# EasyEDA Pro project ProPrj_前板PCB制作_2025-12-27.epro

# Schematic Schematic1
Assembly Variant: Basic; Board Name: Board1; Create Date: 2025-12-19; Page Name: P1; Project Name: 前板PCB制作; Schematic Name: Schematic1; Update Date: 2025-12-19; BladeWidth: 10; Company: 嘉立创EDA; Page Size: A4; RegionStart: 1; ShowBorder: 1; TitleBlock: 1; TitleBlockPosition: 3; Version: V1.0; XRegionCount: 6; YRegionCount: 4
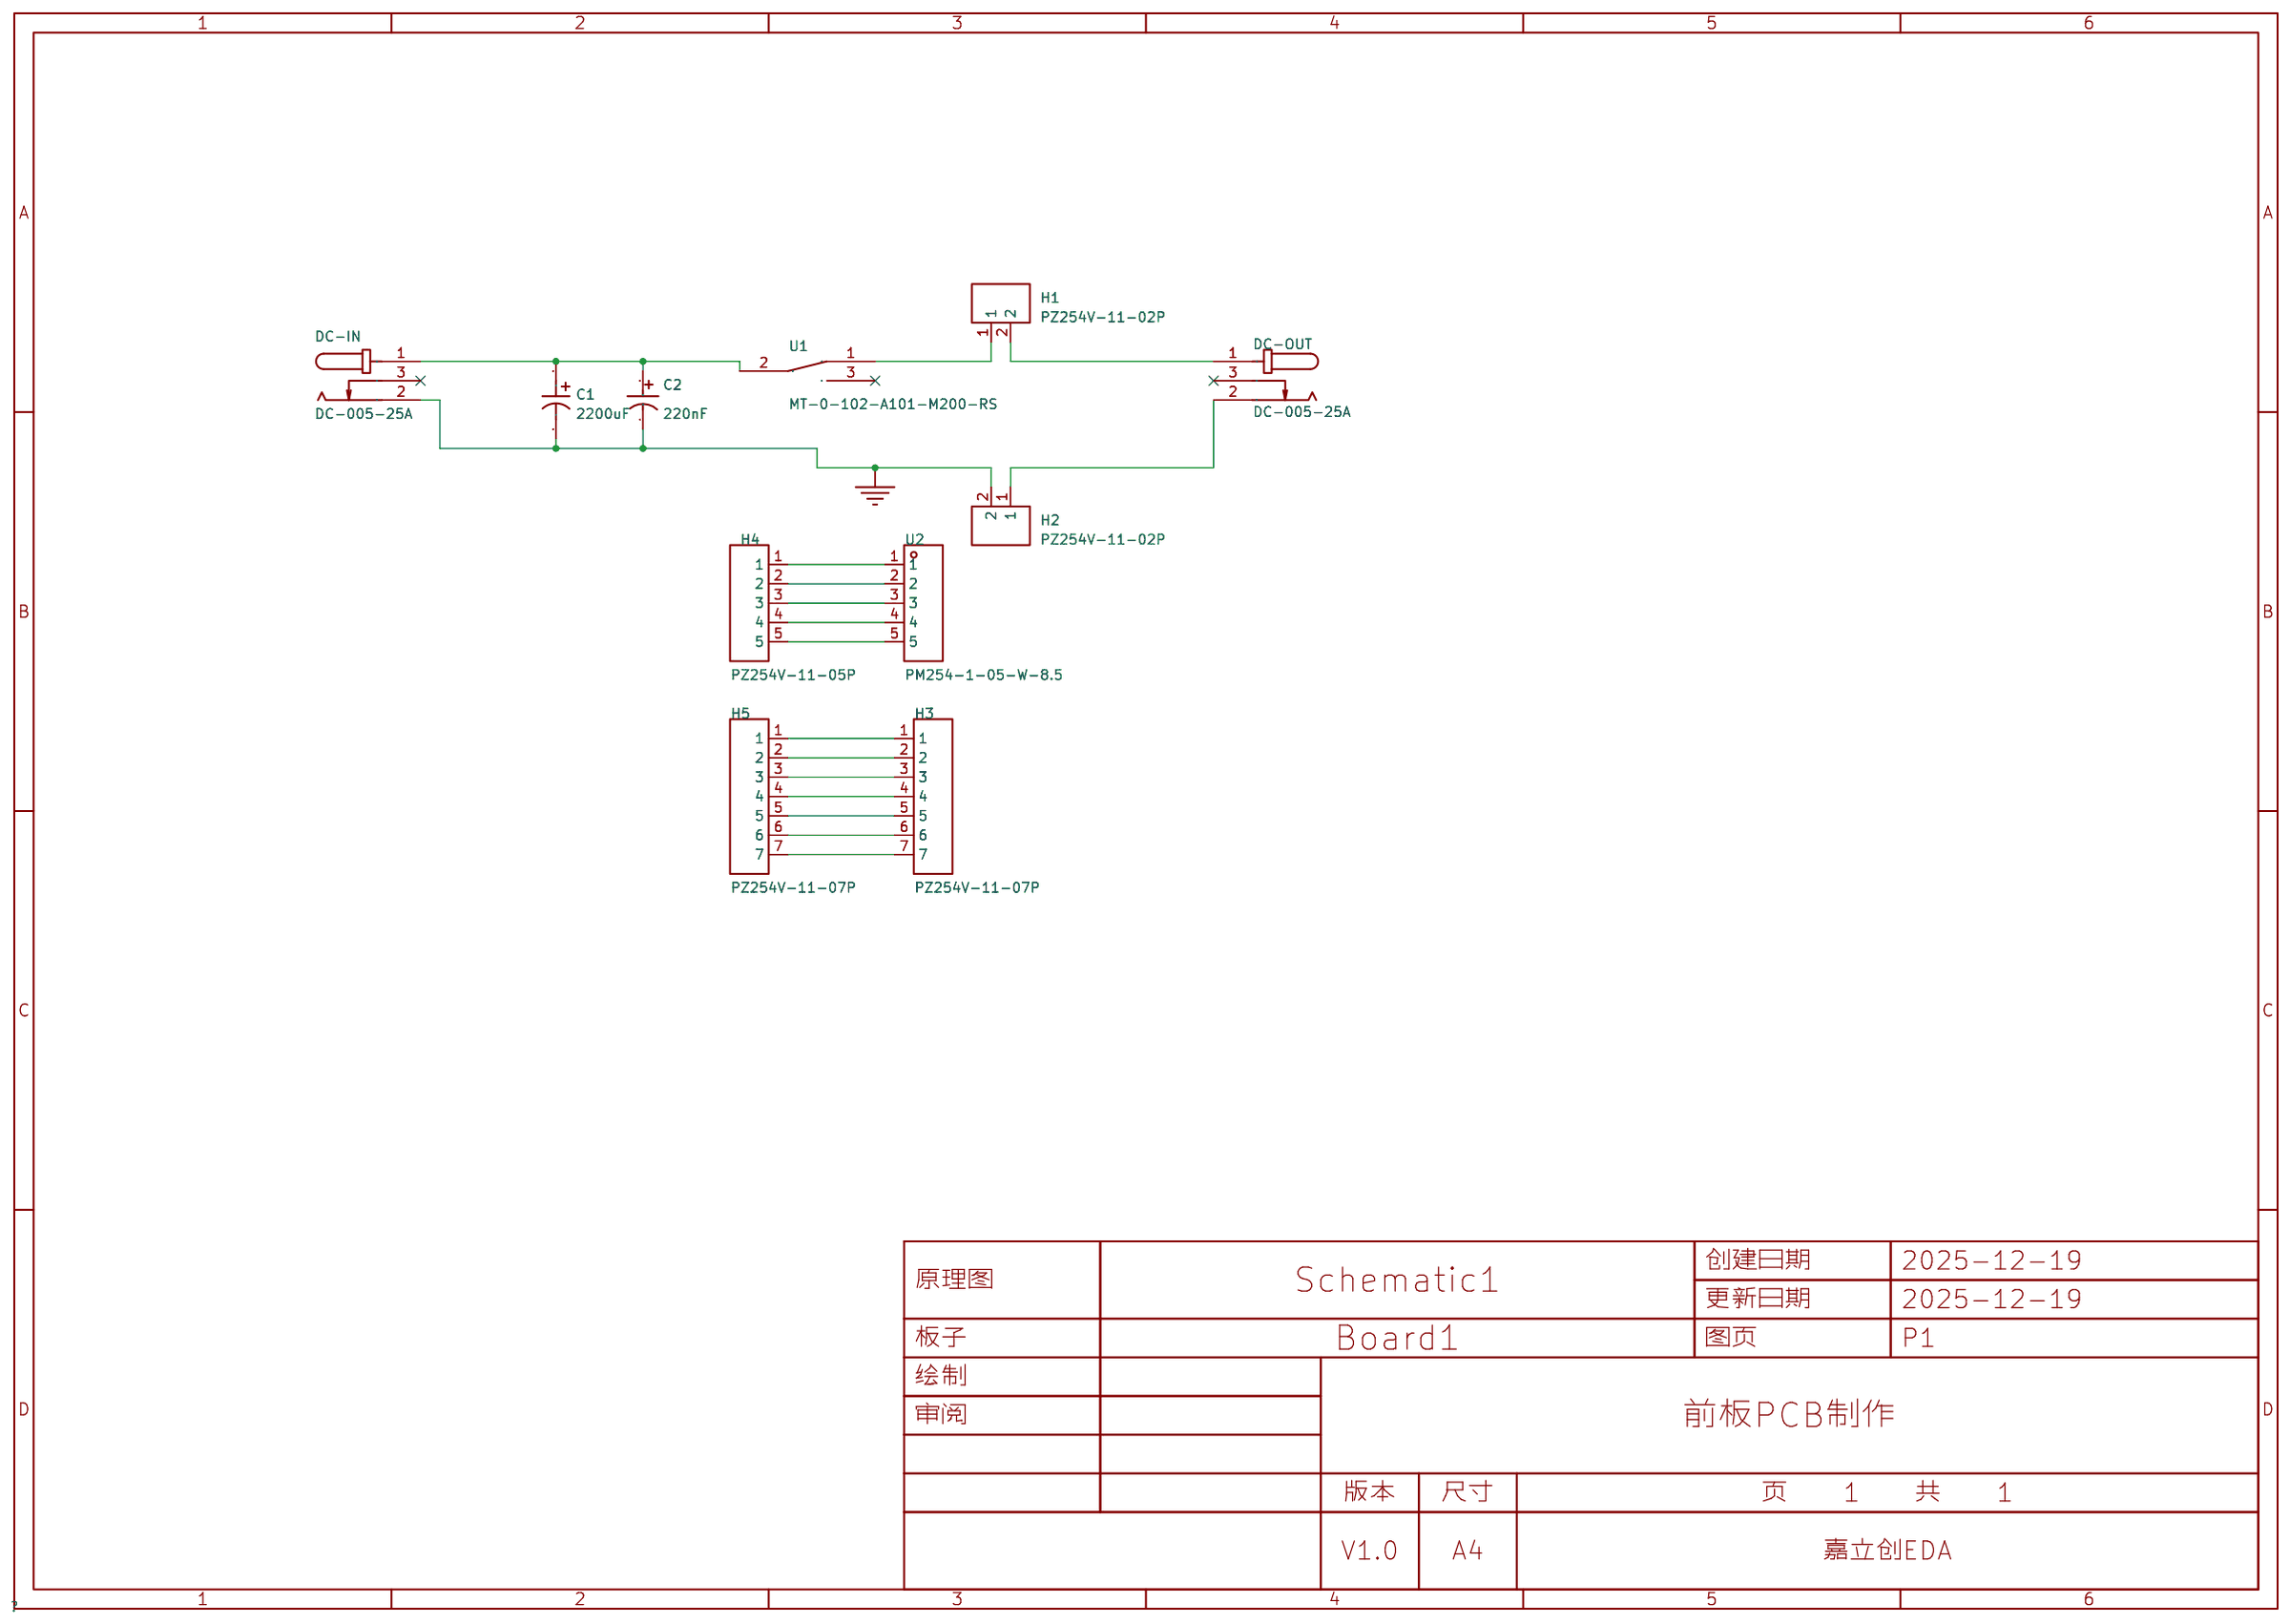
[diagram p0: schematic sheet]

## Parts
C1  2200uF  [CAP-TH_BD13.0-P5.00-D0.6-FD]
C2  220nF  [CAP-TH_BD5.0-P2.00-D0.8-FD]
DC-IN  DC-005-25A  [DC-IN-TH_DC005]
DC-OUT  DC-005-25A  [DC-IN-TH_DC005]
H1  PZ254V-11-02P  [HDR-TH_2P-P2.54-V-M]
H2  PZ254V-11-02P  [HDR-TH_2P-P2.54-V-M]
H3  PZ254V-11-07P  [HDR-TH_7P-P2.54-V-M]
H4  PZ254V-11-05P  [HDR-TH_5P-P2.54-V-M]
H5  PZ254V-11-07P  [HDR-TH_7P-P2.54-V-M]
U1  MT-0-102-A101-M200-RS  [SW-TH_MT-0-103-A101-M200-RS]
U2  PM254-1-05-W-8.5  [HDR-TH_5P-P2.54-H-F-W10.0-N]

## Library data of the parts
C1 = ERA25V2200M13X21: 容值:2200uF;精度:±20%;额定电压:25V;; LCSC Part Name: 2200uF ±20% 25V; Supplier Part: C49256800; Manufacturer: JIERR(捷而瑞); Supplier Footprint: 插件,D13xL21mm; JLCPCB Part Class: Extended Part; Datasheet: https://item.szlcsc.com/datasheet/ERA25V2200M13X21/51692200.html; Supplier: LCSC; Tolerance: ±20%; Voltage Rating: 25V; Pin Spacing: 5mm; Diameter: 13mm; Height - Seated (Max): 21mm; Lifetime: 2000hrs@105℃; Operating Temperature: -40℃~+105℃
C2 = KM224M050D11RR0VH2FP0: 容值:220nF;精度:±20%;额定电压:50V;; LCSC Part Name: 220nF ±20% 50V; Supplier Part: C45096; Manufacturer: Chengx(承兴); Supplier Footprint: 插件,D5xL11mm; JLCPCB Part Class: Extended Part; Datasheet: https://item.szlcsc.com/datasheet/KM224M050D11RR0VH2FP0/46098.html; Supplier: LCSC; Tolerance: ±20%; Voltage Rating: 50V; Pin Spacing: 2mm; Diameter: 5mm; Height - Seated (Max): 11mm; Lifetime: 1000hrs@105℃
DC-IN DC-OUT = DC-005-25A: 连接器类型:DC电源插座;安装方式:弯插;触点内径:2.5mm;触点外径:6.4mm;额定电流:500mA;额定电压:30V;工作温度:-25℃~+80℃;; LCSC Part Name: DC电源插座 内径:2.5mm 外径:6.4mm; Supplier Part: C136715; Manufacturer: 韩国韩荣; Supplier Footprint: 插件; JLCPCB Part Class: Extended Part; Datasheet: https://item.szlcsc.com/datasheet/DC-005-25A/148031.html; Supplier: LCSC; Connector Type: DC电源插座; Mounting Type: 弯插; Inside Contact Diameter: 2.5mm; Outside Contact Diameter: 6.4mm; Current Rating: 500mA; Voltage Rating (Max): 30V; Operating Temperature: -25℃~+80℃
H1 H2 = PZ254V-11-02P: 插针结构:1x2P;间距:2.54mm;行距:-;圆针/方针:方针;安装方式:直插;排数:单排;总PIN位数:2P;额定电流:-;额定电压:-;配合针长度:6mm;塑高:2.5mm;端接针长度:3mm;触头材质:黄铜;触头镀层:-;工作温度:-40℃~+105℃;颜色:黑色;; LCSC Part Name: 1x2P 间距:2.54mm 方针 直插; Supplier Part: C492401; Manufacturer: XFCN(兴飞); Supplier Footprint: 插件,P=2.54mm; JLCPCB Part Class: Extended Part; Datasheet: https://item.szlcsc.com/datasheet/PZ254V-11-02P/502957.html; Supplier: LCSC; Pin Structure: 1x2P; Pitch: 2.54mm; Circluar Pins/Square Pins: 方针; Mounting Type: 直插; Number of Rows: 单排; Number of Pins: 2P; Length of Mating Pin: 6mm; Insulation Height: 2.5mm; Length of End Connection Pin: 3mm; Contact Material: 黄铜; Operating Temperature: -40℃~+105℃; Color: 黑色
H3 H5 = PZ254V-11-07P: 插针结构:1x7P;间距:2.54mm;行距:-;圆针/方针:方针;安装方式:直插;排数:单排;总PIN位数:7P;额定电流:-;额定电压:-;配合针长度:6mm;塑高:2.5mm;端接针长度:3mm;触头材质:黄铜;触头镀层:-;工作温度:-40℃~+105℃;颜色:黑色;; LCSC Part Name: 1x7P 间距:2.54mm 方针 直插; Supplier Part: C492406; Manufacturer: XFCN(兴飞); Supplier Footprint: 插件,P=2.54mm; JLCPCB Part Class: Extended Part; Datasheet: https://atta.szlcsc.com/upload/public/pdf/source/20200309/C492406_654C533EE691117E22DD9F76C114C2D9.pdf; Supplier: LCSC; Pin Structure: 1x7P; Pitch: 2.54mm; Circluar Pins/Square Pins: 方针; Mounting Type: 直插; Number of Rows: 单排; Number of Pins: 7P; Length of Mating Pin: 6mm; Insulation Height: 2.5mm; Length of End Connection Pin: 3mm; Contact Material: 黄铜; Operating Temperature: -40℃~+105℃; Color: 黑色
H4 = PZ254V-11-05P: 插针结构:1x5P;间距:2.54mm;行距:-;圆针/方针:方针;安装方式:直插;排数:单排;总PIN位数:5P;额定电流:-;额定电压:-;配合针长度:6mm;塑高:2.5mm;端接针长度:3mm;触头材质:黄铜;触头镀层:-;工作温度:-40℃~+105℃;颜色:黑色;; LCSC Part Name: 1x5P 间距:2.54mm 方针 直插; Supplier Part: C492404; Manufacturer: XFCN(兴飞); Supplier Footprint: 插件,P=2.54mm; JLCPCB Part Class: Extended Part; Datasheet: https://item.szlcsc.com/datasheet/PZ254V-11-05P/502960.html; Supplier: LCSC; Pin Structure: 1x5P; Pitch: 2.54mm; Circluar Pins/Square Pins: 方针; Mounting Type: 直插; Number of Rows: 单排; Number of Pins: 5P; Length of Mating Pin: 6mm; Insulation Height: 2.5mm; Length of End Connection Pin: 3mm; Contact Material: 黄铜; Operating Temperature: -40℃~+105℃; Color: 黑色
U1 = MT-0-102-A101-M200-RS: 电路结构:单刀双掷;工作寿命:-;额定电流:5A;额定电压(AC):125V;安装方式:直插;; LCSC Part Name: 五件套 小型钮子三脚二档; Supplier Part: C1788492; Manufacturer: YUEN FUNG(源丰); Supplier Footprint: 插件,13x8mm; JLCPCB Part Class: Extended Part; Datasheet: https://item.szlcsc.com/datasheet/MT-0-102-A101-M200-RS/1879283.html; Supplier: LCSC; Circuit: 单刀双掷; Length: 13mm; Width: 8mm; Switch Height: 28.6mm; Current Rating: 5A; Voltage Rating (AC): 125V; Actuator Type: 圆柱钮柄; Termination Style: 焊片; Mounting Type: 直插; Operating Temperature: -25℃~+85℃
U2 = PM254-1-05-W-8.5: 插孔结构:1x5P;间距:2.54mm;行距:-;圆孔/方孔:方孔;安装方式:弯插;排数:单排;总孔位数:5P;额定电流:3A;额定电压:-;插孔方向:侧面;塑高:8.5mm;触头材质:铜合金;工作温度:-40℃~+105℃;; LCSC Part Name: 1x5P 间距:2.54mm 弯插; Supplier Part: C2897387; Manufacturer: HCTL(华灿天禄); Supplier Footprint: 弯插,P=2.54mm; JLCPCB Part Class: Extended Part; Datasheet: https://item.szlcsc.com/datasheet/PM254-1-05-W-8.5/3142392.html; Supplier: LCSC; Holes Structure: 1x5P; Pitch: 2.54mm; Circular Hole / Square Hole: 方孔; Mounting Type: 弯插; Number of Rows: 单排; Number of Positions: 5P; Current Rating: 3A; Holes Direction: 侧面; Insulation Height: 8.5mm; Contact Material: 铜合金; Operating Temperature: -40℃~+105℃

## Nets
GND: C1.2 C2.2 DC-IN.2 H2.2
$1N1: C1.1 C2.1 DC-IN.1 U1.2
$1N3: H1.1 U1.1
$1N4: DC-OUT.1 H1.2
$1N6: H4.1 U2.1
$1N7: H4.2 U2.2
$1N8: H4.3 U2.3
$1N9: H4.4 U2.4
$1N10: H4.5 U2.5
$1N11: H3.1 H5.1
$1N12: H3.2 H5.2
$1N13: H3.3 H5.3
$1N14: H3.4 H5.4
$1N15: H3.5 H5.5
$1N16: H3.6 H5.6
$1N17: H3.7 H5.7
$1N20: DC-OUT.2 H2.1

Not connected (* = marked no-connect by the designer): DC-IN 3*; DC-OUT 3*; U1 3*

# Board PCB1
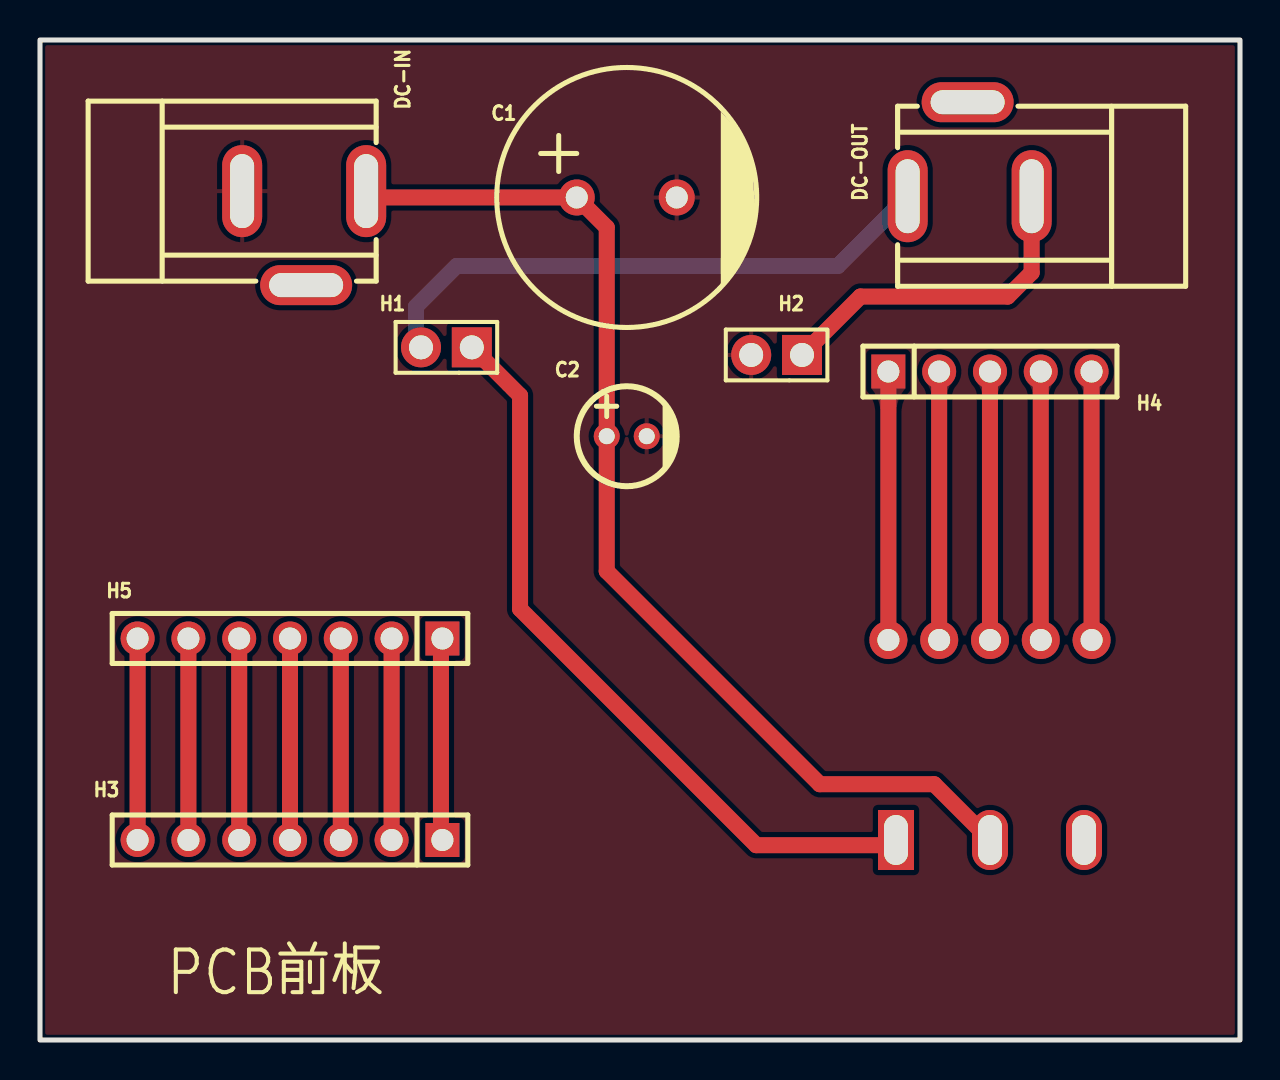
[diagram p1: board, top side]
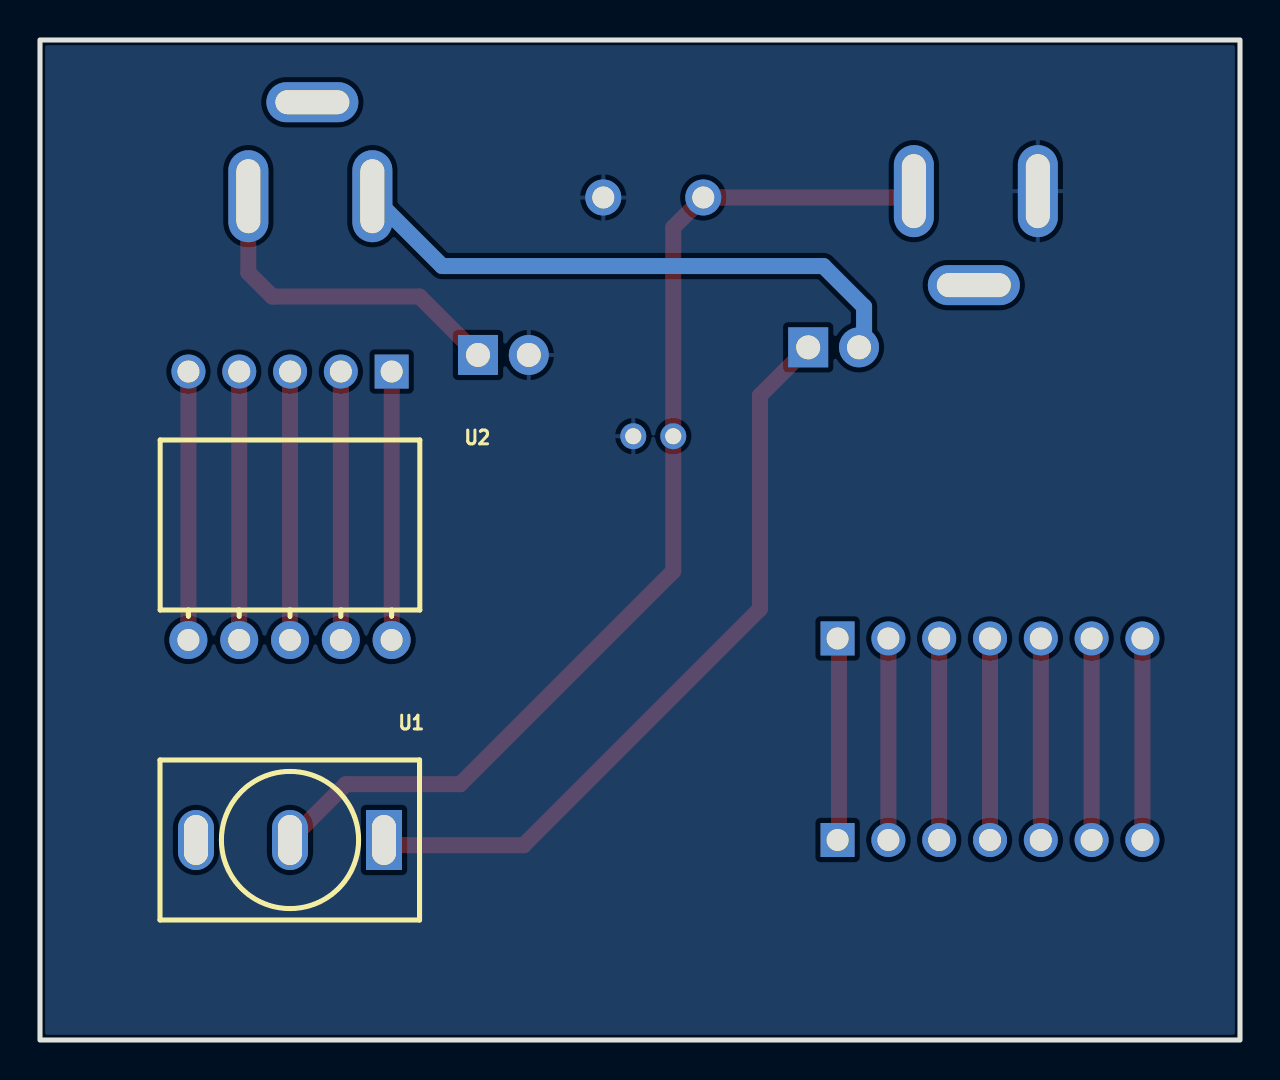
[diagram p2: board, bottom side, seen from below]

Outline 60 x 50 mm; copper layers: Top Layer, Bottom Layer. Coordinates in mm from the lower left corner of the outline.
Outline path: rectangle 0,50 60,0
Stack: Top Layer 0.035mm / Dielectric1 1.51mm FR4 er 4.5 / Bottom Layer 0.035mm

## Design rules (mm)
spacing copperThickness1oz (default): track to track 0.102, other pairs 0.152 to 0.3
spacing copperThickness2oz: track to track 0.203, other pairs 0.152 to 0.3
track width copperThickness1oz (default): min 0.127, default 0.254, max 2.54
track width copperThickness2oz: min 0.203, default 0.254, max 2.54
differential pair differentialPair (default): width min 0.127, default 0.254, max 2.54; gap min 0.152, default 0.152
net GND uses copperRegion

## Placement (name value [footprint] x y rotation side)
C1  2200uF  [CAP-TH_BD13.0-P5.00-D0.6-FD]  29.34 42.13 0 top
C2  220nF  [CAP-TH_BD5.0-P2.00-D0.8-FD]  29.34 30.19 0 top
DC-IN  DC-005-25A  [DC-IN-TH_DC005]  13.21 40.09 0 top
DC-OUT  DC-005-25A  [DC-IN-TH_DC005]  46.48 44.54 180 top
H1  PZ254V-11-02P  [HDR-TH_2P-P2.54-V-M]  20.32 34.63 180 top
H2  PZ254V-11-02P  [HDR-TH_2P-P2.54-V-M]  36.83 34.25 180 top
H3  PZ254V-11-07P  [HDR-TH_7P-P2.54-V-M]  12.5 10 180 top
H4  PZ254V-11-05P  [HDR-TH_5P-P2.54-V-M]  47.5 33.42 0 top
H5  PZ254V-11-07P  [HDR-TH_7P-P2.54-V-M]  12.5 20.08 180 top
U1  MT-0-102-A101-M200-RS  [SW-TH_MT-0-103-A101-M200-RS]  47.5 10 0 bottom
U2  PM254-1-05-W-8.5  [HDR-TH_5P-P2.54-H-F-W10.0-N]  47.5 20 0 bottom

## Footprints (pads in the part's own frame, mm; a bottom-side part is the same pattern mirrored in y, then rotated)
CAP-TH_BD5.0-P2.00-D0.8-FD
  round 1.3 hole 0.8: 1(-1,0) 2(1,0)
CAP-TH_BD13.0-P5.00-D0.6-FD
  round 1.8 hole 1.1: 1(-2.5,0) 2(2.5,0)
DC-IN-TH_DC005
  oval 2x4.6 hole 1.2x3.7: 1(3.1,2.35) 2(-3.1,2.35)
  oval 4.6x2 hole 3.7x1.2: 3(0.1,-2.35)
HDR-TH_2P-P2.54-V-M
  rect 2x2 hole 1.2: 1(-1.27,0)
  round 2 hole 1.2: 2(1.27,0)
HDR-TH_5P-P2.54-H-F-W10.0-N
  round 1.9 hole 1.1: 1(-5.08,0) 2(-2.54,0) 3(0,0) 4(2.54,0) 5(5.08,0)
HDR-TH_5P-P2.54-V-M
  rect 1.7x1.7 hole 1.1: 1(-5.08,0)
  round 1.7 hole 1.1: 2(-2.54,0) 3(0,0) 4(2.54,0) 5(5.08,0)
HDR-TH_7P-P2.54-V-M
  rect 1.7x1.7 hole 1.1: 1(-7.62,0)
  round 1.7 hole 1.1: 2(-5.08,0) 3(-2.54,0) 4(0,0) 5(2.54,0) 6(5.08,0) 7(7.62,0)
SW-TH_MT-0-103-A101-M200-RS
  rect 1.8x3 hole 1.2x2.5: 1(-4.7,0)
  oval 1.8x3 hole 1.2x2.5: 2(0,0) 3(4.7,0)

## Nets
As in the schematic.

Pads without a net: DC-IN 3; DC-OUT 3; U1 3

## Routing (per net, layer and track width the routed paths; a pad name or vN(x,y) marks a point on that pad's centre or on a via; arc(x,y) is an arc through that point)
$1N1: length 54.7
  Top Layer w0.8: DC-IN.1 16.63,42.13 C1.1 28.34,40.63 C2.1 28.34,23.44 38.99,12.79 44.71,12.79 U1.2
$1N3: length 37.9
  Top Layer w0.8: U1.1 42.54,9.74 35.81,9.74 24,21.55 24,32.22 H1.1
$1N4: length 29
  Bottom Layer w0.8: DC-OUT.1 39.89,38.7 20.83,38.7 18.8,36.67 18.8,34.89 H1.2
$1N6: length 13.9
  Top Layer w0.8: 42.16,33.38 42.42,33.12 42.42,19.58
$1N7: length 13.9
  Top Layer w0.8: 44.96,19.58 44.96,33.12 44.7,33.38
$1N8: length 13.9
  Top Layer w0.8: 47.24,33.38 47.5,33.12 47.5,19.58
$1N9: length 13.9
  Top Layer w0.8: 49.78,33.38 50.04,33.12 50.04,19.58
$1N10: length 13.9
  Top Layer w0.8: 52.32,33.38 52.58,33.12 52.58,19.58
$1N11: length 9.3
  Top Layer w0.8: 20.45,20.08 20.05,19.68 20.05,10.91
$1N12: length 10.2
  Top Layer w0.8: H3.2 17.58,19.75 17.91,20.08
$1N13: length 10.2
  Top Layer w0.8: H3.3 15.04,19.75 15.37,20.08
$1N14: length 10.2
  Top Layer w0.8: H3.4 12.5,19.75 12.83,20.08
$1N15: length 10.2
  Top Layer w0.8: 10.29,20.08 9.96,19.75 H3.5
$1N16: length 10.2
  Top Layer w0.8: H3.6 7.42,19.75 7.75,20.08
$1N17: length 10.2
  Top Layer w0.8: 5.21,20.08 4.88,19.75 H3.7
$1N20: length 17
  Top Layer w0.8: H2.1 41.02,37.17 48.39,37.17 49.58,38.37 DC-OUT.2

## Copper pours and planes (outline as drawn; the poured copper is in the pictures)
GND on Top Layer: -3.3,52.41 66.29,52.41 66.29,-7.53 -3.3,-7.53
GND on Bottom Layer: -4.44,52.16 66.04,52.16 66.04,-4.99 -4.44,-4.99

Small or netless copper shapes (teardrops, artwork), in the pictures only: 5 on Top Layer

## Text on the board
Top Silkscreen Layer: PCB前板
